# Altium schematic sheet ds18b20.SchDoc
size A4; SheetNumber: 14; SheetTotal: 14
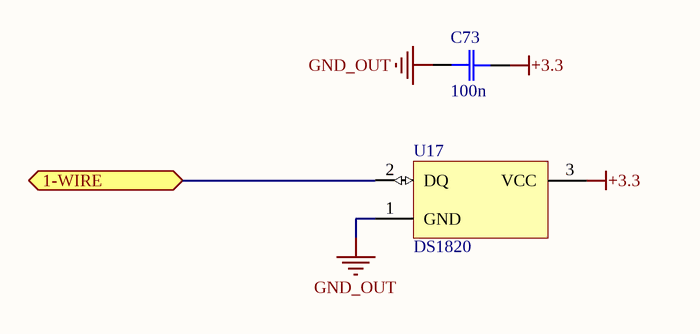
[diagram p0: ds18b20.SchDoc]

## Parts
C73  100n  [CAP: 0603]
U17  DS1820  [PR35]

## Ports
1-WIRE (bidir)

## Nets
+3.3: C73.1 U17.3(VCC)
GND_OUT: C73.2 U17.1(GND)
1-WIRE: U17.2(DQ) ; port 1-WIRE

## Library data of the parts
C73 = C_SMD: Value: 100n
U17 = DS1820: 1-Wire Digital Thermometer; ComponentAvailability: Obsolete; Published: 13-Oct-2000; LatestRevisionDate: 17-Jul-2002; LatestRevisionNote: Re-released for DXP Platform.; DatasheetVersion: 5-Mar-1998; PackageVersion: 1999; PackageReference: PR35; Publisher: Altium Limited; PackageDescription: TO, Flat Index; 3 In-Line, Axial Leads; Body Dia. 4.6mm; Leads 0.56 x 0.51 mm (max); ComponentLink1Description: Manufacturer Link; ComponentLink1URL: http://www.maxim-ic.com/; ComponentLink2Description: Datasheet; ComponentLink2URL: http://pdfserv.maxim-ic.com/en/ds/DS1820-DS1820S.pdf; ComponentLink3Description: Discontinuation Notice; ComponentLink3URL: http://www.maxim-ic.com/qa/pdfs/non-obsolescence-letter.pdf